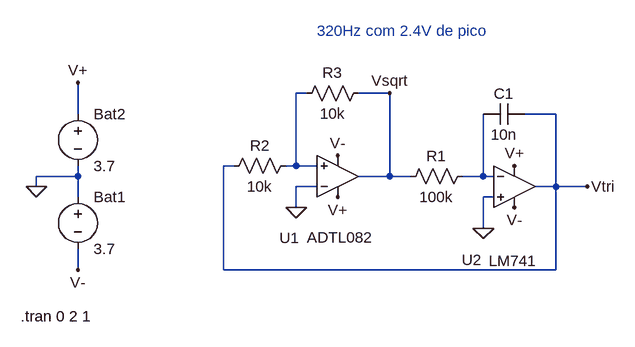
[diagram p0: schematic Oscilador_astavel.asc]
Oscilador_astavel.asc, the LTspice schematic file:
Version 4
SHEET 1 880 680
WIRE -48 -64 -64 -64
WIRE 80 -64 32 -64
WIRE -400 -32 -400 -80
WIRE 336 -32 288 -32
WIRE -160 48 -176 48
WIRE -64 48 -64 -64
WIRE -64 48 -80 48
WIRE -32 48 -64 48
WIRE -400 64 -400 48
WIRE -400 64 -464 64
WIRE 80 64 80 -64
WIRE 80 64 32 64
WIRE 112 64 80 64
WIRE 224 64 224 -32
WIRE 224 64 192 64
WIRE 240 64 224 64
WIRE -464 80 -464 64
WIRE -32 80 -64 80
WIRE 336 80 336 -32
WIRE 336 80 304 80
WIRE 384 80 336 80
WIRE -400 96 -400 64
WIRE 240 96 224 96
WIRE -64 112 -64 80
WIRE 224 144 224 96
WIRE -400 208 -400 176
WIRE -176 208 -176 48
WIRE 336 208 336 80
WIRE 336 208 -176 208
FLAG -400 -80 V+
FLAG 272 48 V+
FLAG 0 96 V+
FLAG -464 80 0
FLAG -400 208 V-
FLAG 0 32 V-
FLAG 272 112 V-
FLAG 224 144 0
FLAG -64 112 0
FLAG 384 80 Vtri
FLAG 80 -64 Vsqrt
SYMBOL OpAmps\\ADTL082 0 128 M180
WINDOW 0 -90 -31 Left 2
WINDOW 3 -47 -30 Left 2
SYMATTR InstName U1
SYMBOL OpAmps\\LM741 272 16 R0
WINDOW 0 -81 177 Left 2
WINDOW 3 -39 178 Left 2
SYMATTR InstName U2
SYMBOL voltage -400 80 R0
SYMATTR InstName Bat1
SYMATTR Value 3.7
SYMBOL voltage -400 -48 R0
SYMATTR InstName Bat2
SYMATTR Value 3.7
SYMBOL res 208 48 R90
WINDOW 0 0 56 VBottom 2
WINDOW 3 32 56 VTop 2
SYMATTR InstName R1
SYMATTR Value 100k
SYMBOL res -64 32 R90
WINDOW 0 0 56 VBottom 2
WINDOW 3 32 56 VTop 2
SYMATTR InstName R2
SYMATTR Value 10k
SYMBOL res 48 -80 R90
WINDOW 0 0 56 VBottom 2
WINDOW 3 32 56 VTop 2
SYMATTR InstName R3
SYMATTR Value 10k
SYMBOL cap 288 -48 R90
WINDOW 0 0 32 VBottom 2
WINDOW 3 32 32 VTop 2
SYMATTR InstName C1
SYMATTR Value 10n
TEXT -488 280 Left 2 !.tran 0 2 1
TEXT -32 -160 Left 2 ;320Hz com 2.4V de pico

The netlist it stands for:
* Oscilador_astavel.asc
XU1 N001 0 V+ V- Vsqrt ADTL082  ; pins In+ In- V+ V- OUT
XU2 0 N002 V+ V- Vtri LM741  ; pins In+ In- V+ V- OUT
V§Bat1 0 V- 3.7
V§Bat2 V+ 0 3.7
R1 N002 Vsqrt 100k
R2 N001 Vtri 10k
R3 Vsqrt N001 10k
C1 Vtri N002 10n
.tran 0 2 1
* 320Hz com 2.4V de pico
.lib ADI.lib
.lib LM741.lib
.backanno
.end